# Altium schematic sheet bt_current_monitor.SchDoc
size A4; SheetNumber: 8; SheetTotal: 19
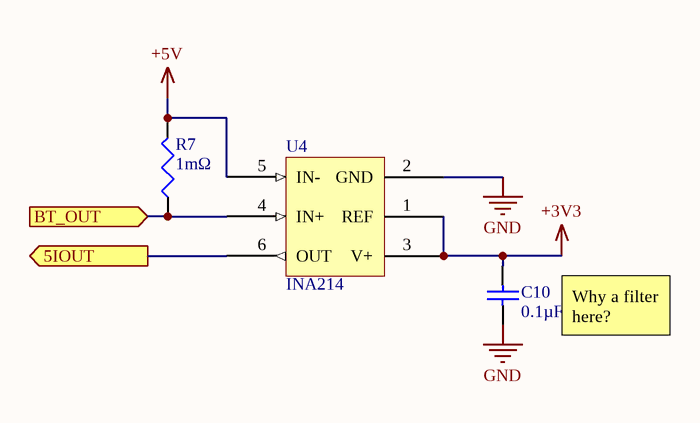
[diagram p0: bt_current_monitor.SchDoc]

## Parts
C10  0.1µF  [1608[0603]]
R7  1mΩ  [J1-0603]
U4  INA214  [SOT65P210X110-6N]

## Ports
5IOUT (out), BT_OUT (in)

## Nets
+3V3: C10.2 U4.1(REF) U4.3(V+)
+5V: R7.2 U4.5(IN-)
GND: C10.1 U4.2(GND)
5IOUT: U4.6(OUT) ; port 5IOUT
BT_OUT: R7.1 U4.4(IN+) ; port BT_OUT

## Notes on the sheet
- (near C10) Why a filter here?

## Library data of the parts
C10 = Cap Semi: Capacitor (Semiconductor SIM Model); Published: 8-Jun-2000; LatestRevisionDate: 29-May-2009; LatestRevisionNote: IPC-7351 Footprint Added.; PackageReference: C1206; Publisher: Altium Limited; PackageDescription: Chip Capacitor; Value: 0.1µF
R7 = Res3: Resistor; Published: 8-Jun-2000; LatestRevisionDate: 29-May-2009; LatestRevisionNote: IPC-7351 Footprint Added.; PackageReference: J1-0603; Publisher: Altium Limited; PackageDescription: Chip Resistor; Value: 1mΩ
U4 = INA214: Current monitor